# EAGLE design PSX_Radio (EAGLE 9.6.2)
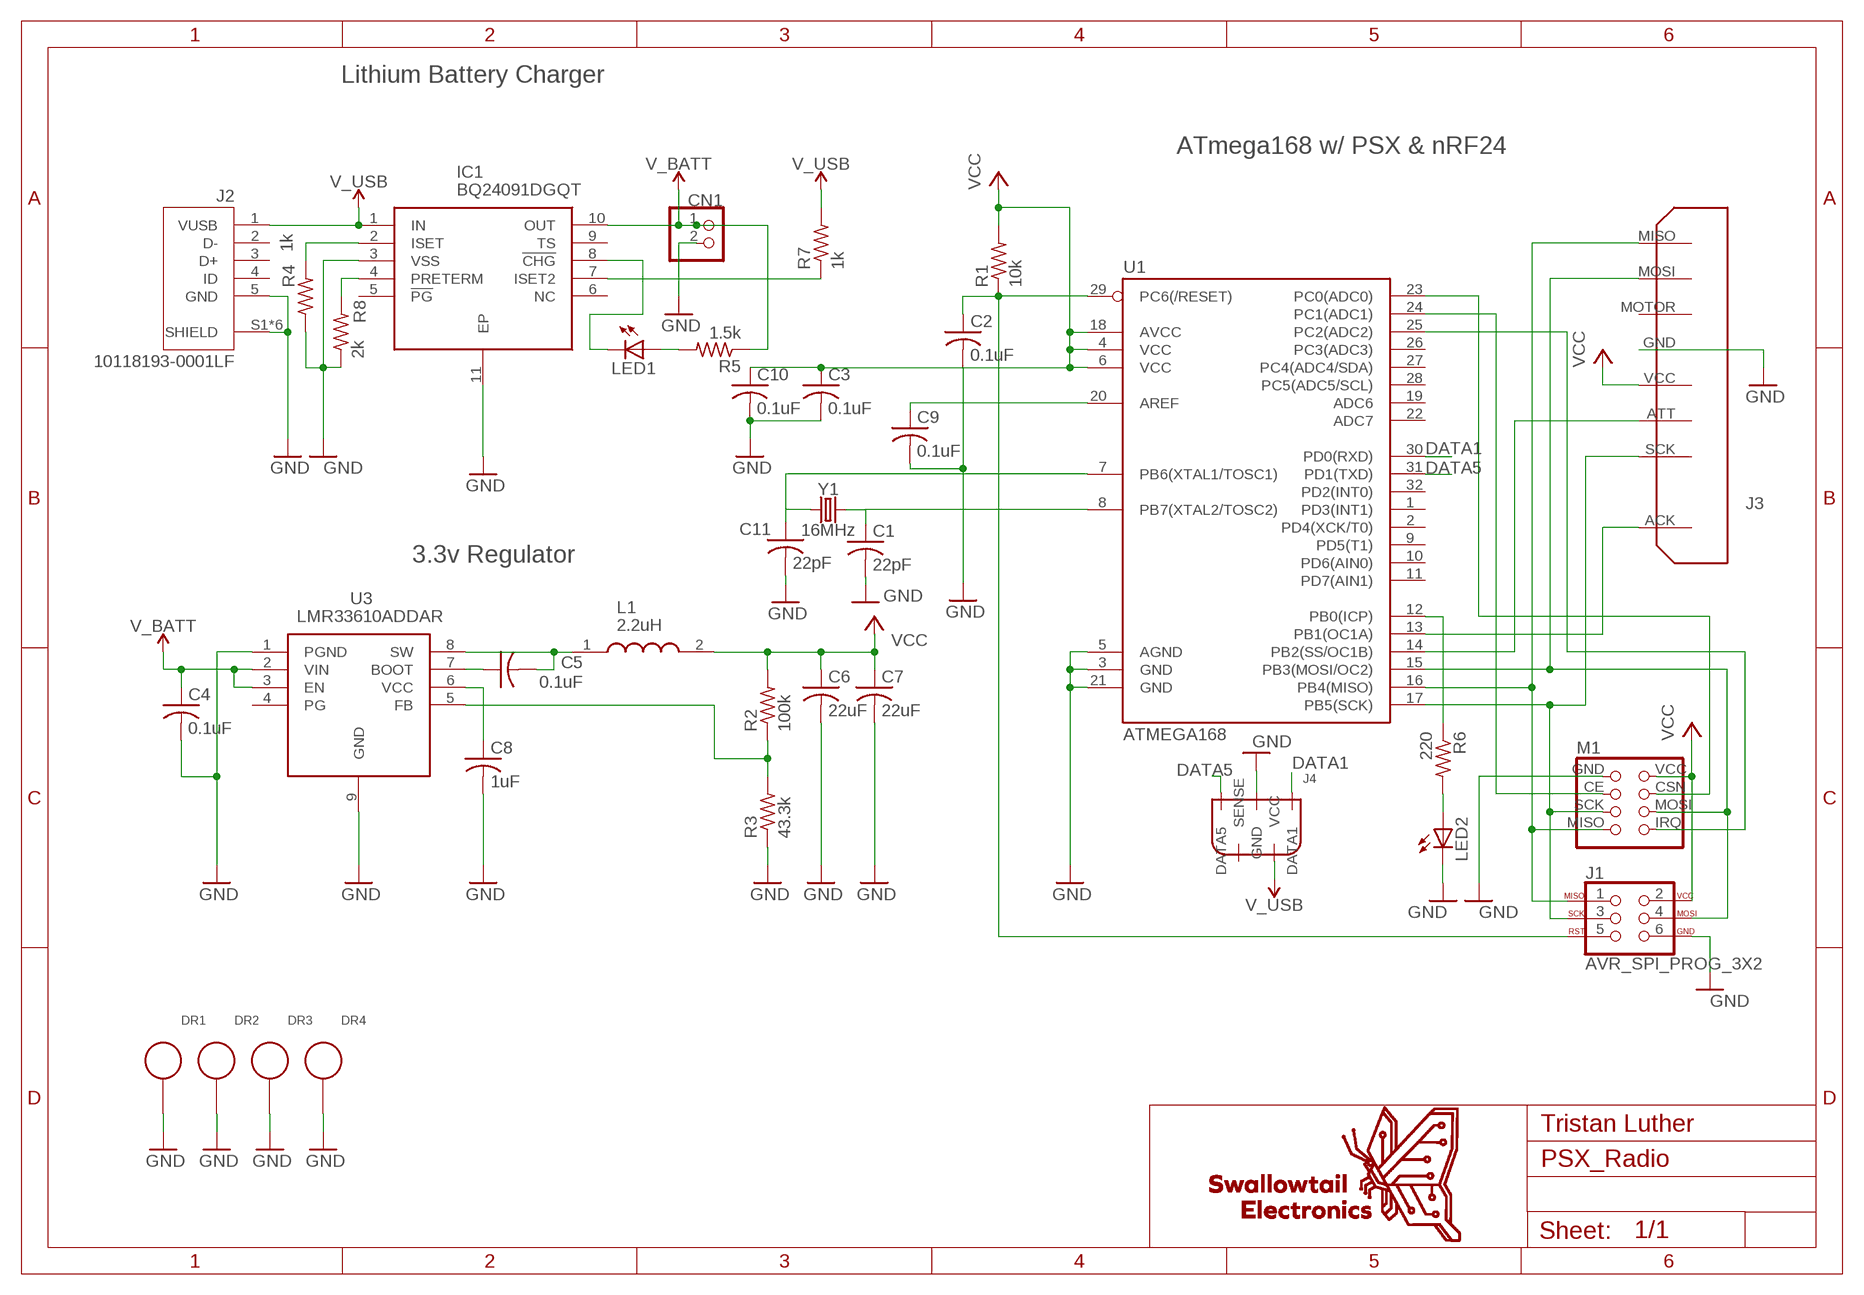
[diagram p0: schematic, sheet 1]

## Parts
C1  22pF  C-USC0805  [C0805]
C2  0.1uF  C-USC0805  [C0805]
C3  0.1uF  C-USC0805  [C0805]
C4  0.1uF  C-USC0805  [C0805]
C5  0.1uF  C-USC0805  [C0805]
C6  22uF  C-USC0805  [C0805]
C7  22uF  C-USC0805  [C0805]
C8  1uF  C-USC0805  [C0805]
C9  0.1uF  C-USC0805  [C0805]
C10  0.1uF  C-USC0805  [C0805]
C11  22pF  C-USC0805  [C0805]
CN1  JST_2PIN-SMT-RA  [JST-PH-2-SMT-RA]
DR1  3MM_DRILL_GND  [3MM_DRILL_GND]
DR2  3MM_DRILL_GND  [3MM_DRILL_GND]
DR3  3MM_DRILL_GND  [3MM_DRILL_GND]
DR4  3MM_DRILL_GND  [3MM_DRILL_GND]
IC1  BQ24091DGQT  [SOP50P490X110-11N]
J1  AVR_SPI_PROG_3X2  [2X3-NS]
J2  10118193-0001LF  [FCI_10118193-0001LF]
J3  PSX_CONTROLLER  [PSX_VERTICAL]
J4  DREAMCAST_CONTROLLER  [1X06]
L1  2.2uH  SRP5015TA-2R2M  [INDPM5752X150N]
LED1  LED5MM  [LED5MM]
LED2  LED5MM  [LED5MM]
M1  NRF24L01_MODULE  [2X04]
R1  10k  R-US_R0805  [R0805]
R2  100k  R-US_R0805  [R0805]
R3  43.3k  R-US_R0805  [R0805]
R4  1k  R-US_R0805  [R0805]
R5  1.5k  R-US_R0805  [R0805]
R6  220  R-US_R0805  [R0805]
R7  1k  R-US_R0805  [R0805]
R8  2k  R-US_R0805  [R0805]
U1  ATMEGA168  [TQFP32-08]
U3  LMR33610ADDAR  [SOIC127P600X170-9N]
Y1  16MHz  CRYSTAL-16MHZSMD-5X3.2  [CRYSTAL-SMD-5X3.2-4PAD]

## Nets
DATA1: J4.2(DATA1) U1.30(PD0(RXD))
DATA5: J4.4(DATA5) U1.31(PD1(TXD))
GND: C1.2 C2.2 C3.2 C4.2 C6.2 C7.2 C8.2 C9.2 C10.2 C11.2 CN1.2 DR1.DR(D$1) DR2.DR(D$1) DR3.DR(D$1) DR4.DR(D$1) IC1.3(VSS) IC1.11(EP) J1.6 J2.5(GND) J2.S1(SHIELD) J2.S2(SHIELD) J2.S3(SHIELD) J2.S4(SHIELD) J2.S5(SHIELD) J2.S6(SHIELD) J3.GND J4.5(GND) LED2.K(C) M1.GND R3.1 R4.1 R8.1 U1.3(GND) U1.5(AGND) U1.21(GND) U3.1(PGND) U3.9(GND)
N$1: J1.1 J3.MISO M1.MISO U1.16(PB4(MISO))
N$2: J1.4 J3.MOSI M1.MOSI U1.15(PB3(MOSI/OC2))
N$3: J3.ACK U1.13(PB1(OC1A))
N$4: M1.IRQ U1.25(PC2(ADC2))
N$5: J1.3 J3.SCK M1.SCK U1.17(PB5(SCK))
N$6: M1.CE U1.24(PC1(ADC1))
N$7: J3.ATT U1.14(PB2(SS/OC1B))
N$8: M1.CSN U1.23(PC0(ADC0))
N$9: C2.1 J1.5 R1.1 U1.29(PC6(/RESET))
N$10: C9.1 U1.20(AREF)
N$11: C5.1 U3.7(BOOT)
N$12: C5.2 L1.1 U3.8(SW)
N$13: IC1.2(ISET) R4.2
N$14: R2.1 R3.2 U3.5(FB)
N$15: C8.1 U3.6(VCC)
N$16: R6.1 U1.12(PB0(ICP))
N$17: LED2.A R6.2
N$18: C1.1 U1.8(PB7(XTAL2/TOSC2)) Y1.3
N$19: C11.1 U1.7(PB6(XTAL1/TOSC1)) Y1.1
N$20: LED1.A R5.2
N$21: IC1.8(!CHG) LED1.K(C)
N$22: IC1.7(ISET2) R7.1
N$23: IC1.4(PRETERM) R8.2
V_BATT: C4.1 CN1.1 IC1.10(OUT) R5.1 U3.2(VIN) U3.3(EN)
V_USB: IC1.1(IN) J2.1(VUSB) J4.1(VCC) R7.2
VCC: C3.1 C6.1 C7.1 C10.1 J1.2 J3.VCC L1.2 M1.VCC R1.2 R2.2 U1.4(VCC) U1.6(VCC) U1.18(AVCC)
Unconnected: IC1.5(!PG) IC1.6(NC) IC1.9(TS) J2.2(D-) J2.3(D+) J2.4(ID) J3.MOTOR J4.6(SENSE) U1.1(PD3(INT1)) U1.2(PD4(XCK/T0)) U1.9(PD5(T1)) U1.10(PD6(AIN0)) U1.11(PD7(AIN1)) U1.19(ADC6) U1.22(ADC7) U1.26(PC3(ADC3)) U1.27(PC4(ADC4/SDA)) U1.28(PC5(ADC5/SCL)) U1.32(PD2(INT0)) U3.4(PG)

## Notes on the sheet
- Lithium Battery Charger
- ATmega168 w/ PSX & nRF24
- 3.3v Regulator

## Library data of the parts
C1-C11 = MyLibrary:C-US: CAPACITOR, American symbol
CN1 = MyLibrary:JST_2PIN: JST 2-Pin Connectors of various flavors SMT-RA (S2B-PH-SM4) 4UConnector #17311 SMT (B2B-PH-SM4) THM-RA (S2B-PH) THM (B2B-PH)
DR1-DR4 = MyLibrary:3MM_DRILL_GND: Common 3mm Machine Screw Hole. Better than your standard drill! Connects to the ground of the circuit board to the enclosure.
IC1 = Swallowtail_PowerManagment:BQ24091DGQT: Texas Instruments BQ24091DGQT, Battery Charge Controller, 1000mA, 10-Pin MSOP Source: Datasheet <http://www.ti.com/lit/gpn/bq24091>; ARROW_PART_NUMBER: BQ24091DGQT; ARROW_PRICE-STOCK: https://www.arrow.com/en/products/bq24091dgqt/texas-instruments; DESCRIPTION: Texas Instruments BQ24091DGQT, Battery Charge Controller, 1000mA, 10-Pin MSOP; HEIGHT: 1.1mm; MANUFACTURER_NAME: Texas Instruments; MANUFACTURER_PART_NUMBER: BQ24091DGQT; MOUSER_PART_NUMBER: 595-BQ24091DGQT; MOUSER_PRICE-STOCK: https://www.mouser.co.uk/ProductDetail/Texas-Instruments/BQ24091DGQT?qs=%252BneE8T2%2Fs3QJg504Q752sQ%3D%3D
J1 = MyLibrary:AVR_SPI_PROG_3X2: AVR ISP 6 Pin This is the reduced ISP connector for AVR programming. Common on Arduino. This footprint will take up less PCB space and can be used with a 10-pin to 6-pin adapter such as SKU: BOB-08508 **Special note about "TEST_POINT" package. The stop mask is on the top side, so if you want your programming test points to be on the bottom of your board, make sure to place this package on the bottom side of the board. This also ensure that the orientation to program from the bottom side will be correct. SparkFun Products: SparkFun ISP Pogo Adapter <https://www.sparkfun.com/products/11591> - NS Tiny AVR Programmer <https://www.sparkfun.com/products/11801> -PTH
J2 = MyLibrary:10118193-0001LF: Micro USB B Type Receptacle; AVAILABILITY: Unavailable; DESCRIPTION: USB - micro B USB 2.0 Receptacle Connector 5 Position Surface Mount, Right Angle; Through Hole; MF: Amphenol ICC; MP: 10118193-0001LF; PACKAGE: None; PRICE: None
J3 = MyLibrary:PSX_CONTROLLER
J4 = MyLibrary:DREAMCAST_CONTROLLER
L1 = MyLibrary:SRP5015TA-2R2M: Bourns SRP5015TA Series Shielded Wire-wound SMD Inductor with a Carbonyl Powder Core, 2.2 H Wire-Wound 4A Idc Q:10 Source: Datasheet <https://www.bourns.com/docs/Product-Datasheets/SRP5015TA.pdf>; ARROW_PART_NUMBER: SRP5015TA-2R2M; ARROW_PRICE-STOCK: https://www.arrow.com/en/products/srp5015ta-2r2m/bourns; DESCRIPTION: Bourns SRP5015TA Series Shielded Wire-wound SMD Inductor with a Carbonyl Powder Core, 2.2 H Wire-Wound 4A Idc Q:10; HEIGHT: 1.5mm; MANUFACTURER_NAME: Bourns; MANUFACTURER_PART_NUMBER: SRP5015TA-2R2M; MOUSER_PART_NUMBER: 652-SRP5015TA-2R2M; MOUSER_PRICE-STOCK: https://www.mouser.co.uk/ProductDetail/Bourns/SRP5015TA-2R2M?qs=ZwKJWZfDtNjiXC2UrFyYsA%3D%3D
LED1 LED2 = MyLibrary:LED: LED OSRAM: - CHIPLED LG R971, LG N971, LY N971, LG Q971, LY Q971, LO R971, LY R971 LH N974, LH R974 LS Q976, LO Q976, LY Q976 LO Q996 - Hyper CHIPLED LW Q18S LB Q993, LB Q99A, LB R99A - SideLED LS A670, LO A670, LY A670, LG A670, LP A670 LB A673, LV A673, LT A673, LW A673 LH A674 LY A675 LS A676, LA A676, LO A676, LY A676, LW A676 LS A679, LY A679, LG A679 - Hyper Micro SIDELED® LS Y876, LA Y876, LO Y876, LY Y876 LT Y87S - SmartLED LW L88C, LW L88S LB L89C, LB L89S, LG L890 LS L89K, LO L89K, LY L89K LS L896, LA L896, LO L896, LY L896 - TOPLED LS T670, LO T670, LY T670, LG T670, LP T670 LSG T670, LSP T670, LSY T670, LOP T670, LYG T670 LG T671, LOG T671, LSG T671 LB T673, LV T673, LT T673, LW T673 LH T674 LS T676, LA T676, LO T676, LY T676, LB T676, LH T676, LSB T676, LW T676 LB T67C, LV T67C, LT T67C, LS T67K, LO T67K, LY T67K, LW E67C LS E67B, LA E67B, LO E67B, LY E67B, LB E67C, LV E67C, LT E67C LW T67C LS T679, LY T679, LG T679 LS T770, LO T770, LY T770, LG T770, LP T770 LB T773, LV T773, LT T773, LW T773 LH T774 LS E675, LA E675, LY E675, LS T675 LS T776, LA T776, LO T776, LY T776, LB T776 LHGB T686 LT T68C, LB T68C - Hyper Mini TOPLED® LB M676 - Mini TOPLED Santana® LG M470 LS M47K, LO M47K, LY M47K Source: http://www.osram.convergy.de/
M1 = MyLibrary:NRF24L01_MODULE: NRF24L01 2.4GHz Radio Module
R1-R8 = MyLibrary:R-US_: RESISTOR, American symbol
U1 = MyLibrary:ATMEGA168: ATMEGA 168 Atmel 32-pin 8-bit micro, 16k flash. SparkFun Products SparkFun Serial Graphic LCD 128x64 <https://www.sparkfun.com/products/9351> (LCD-09351) SparkFun Graphic LCD Serial Backpack <https://www.sparkfun.com/products/9352> (LCD-09352) SparkFun Serial Graphic LCD 160x128 <https://www.sparkfun.com/products/8884> (LCD-08884); PROD_ID: IC-08594
U3 = MyLibrary:LMR33610ADDAR: SIMPLE SWITCHER 3.8V to 36V, 3A Synchronous Buck Converter With Ultra-Low EMI Source: Datasheet <http://www.ti.com/lit/gpn/lmr33630>; ARROW_PART_NUMBER: LMR33630ADDAR; ARROW_PRICE-STOCK: https://www.arrow.com/en/products/lmr33630addar/texas-instruments; DESCRIPTION: SIMPLE SWITCHER 3.8V to 36V, 3A Synchronous Buck Converter With Ultra-Low EMI; HEIGHT: 1.7mm; MANUFACTURER_NAME: Texas Instruments; MANUFACTURER_PART_NUMBER: LMR33630ADDAR; MOUSER_PART_NUMBER: 595-LMR33630ADDAR; MOUSER_PRICE-STOCK: https://www.mouser.co.uk/ProductDetail/Texas-Instruments/LMR33630ADDAR?qs=r5DSvlrkXmJQkBTqgVdiDA%3D%3D
Y1 = MyLibrary:CRYSTAL-16MHZ: 16MHz Crystal Digikey Example <http://www.digikey.com/product-search/en?keywords=535-9122-1-ND> Frequency: 16MHz Frequency Stability: ±50ppm Frequency Tolerance: ±20ppm Load Capacitance: 18pF SparkFun Products: Pro Micro -5V/16MHz <https://www.sparkfun.com/products/12640> SparkFun Serial Enabled LCD Kit <https://www.sparkfun.com/products/10097>; PROD_ID: XTAL-08218; SF_ID: COM-00094

## Board
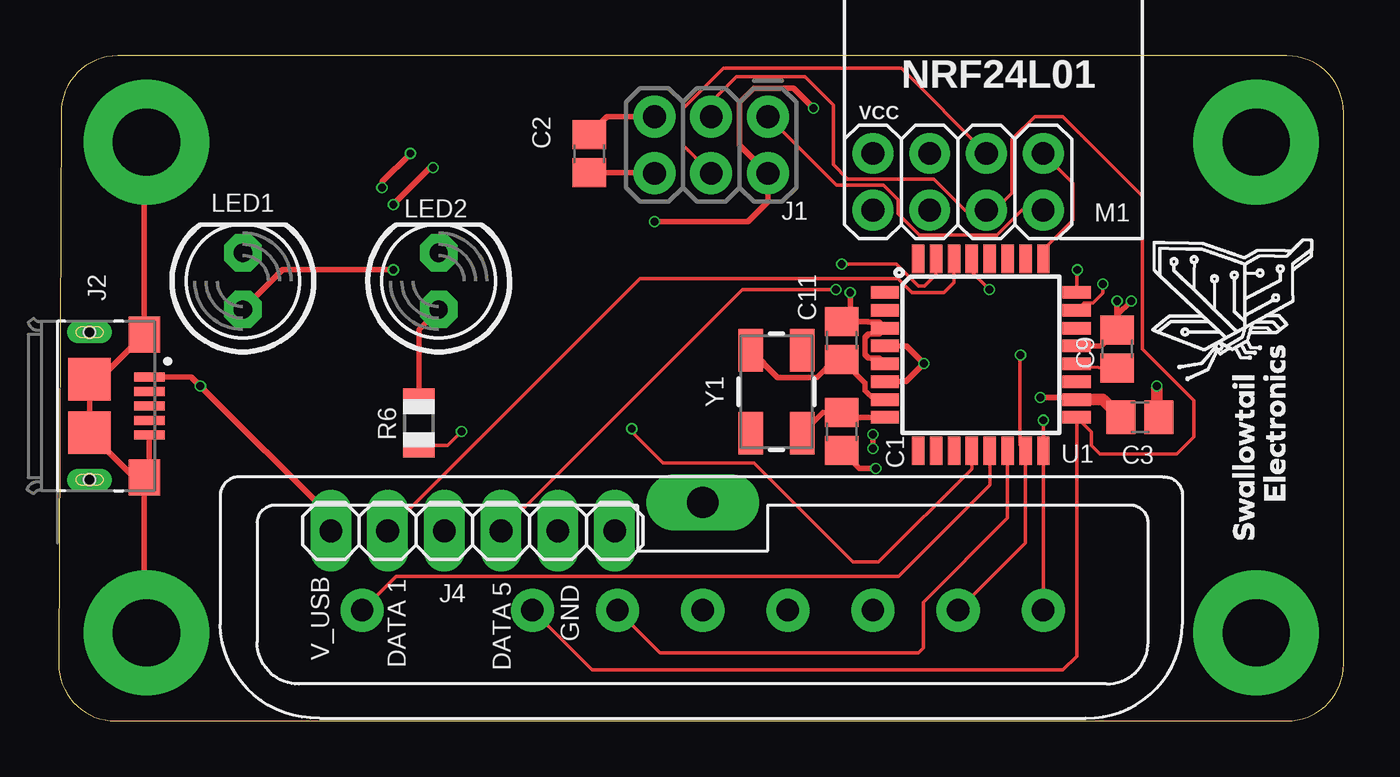
[diagram p1: board, top side]
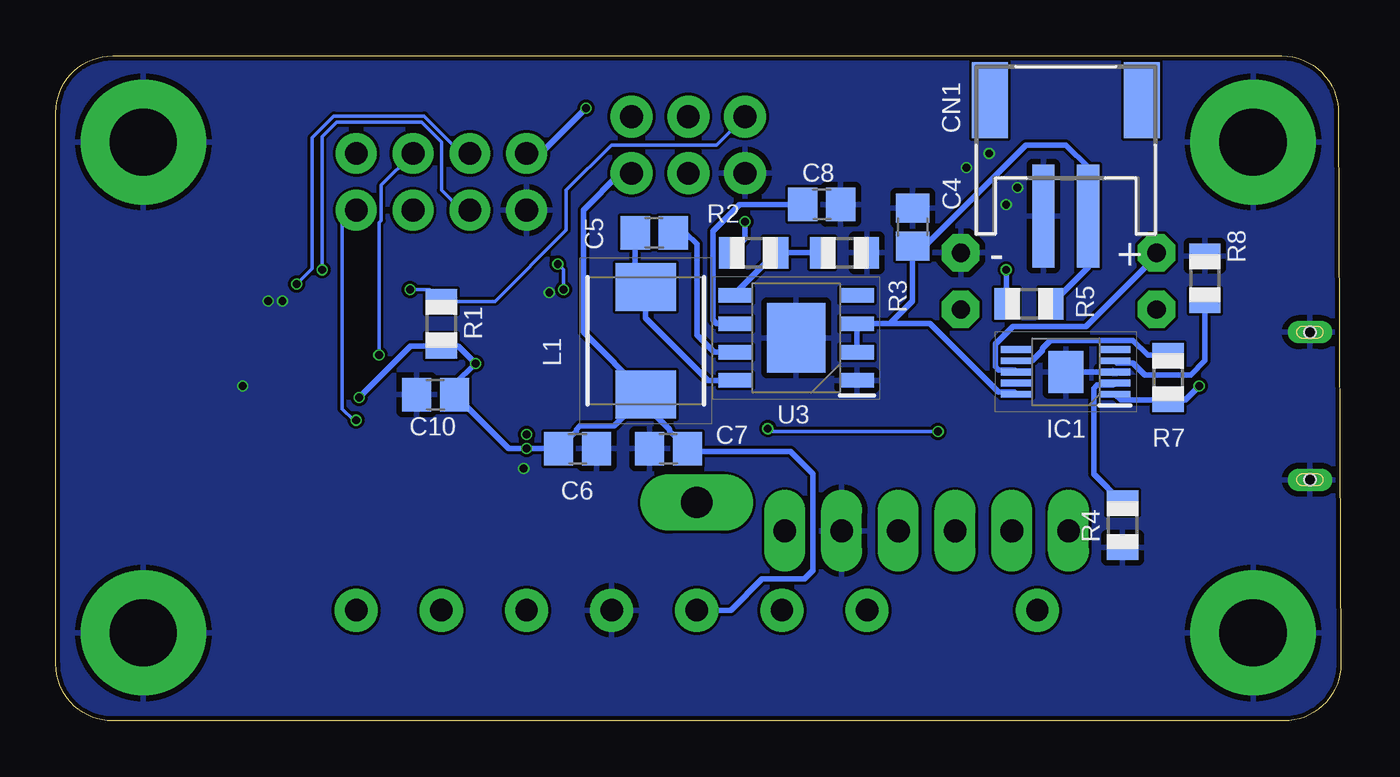
[diagram p2: board, bottom side, seen from below]

Size 57.5 x 29.77 mm. Coordinates in mm from the lower left corner, seen from the top.
Outline: 0.11,27.24 0,2.55 arc90 2.54,0 54.96,0 arc90 57.5,2.54 57.5,27.23 arc90 54.96,29.77 2.65,29.77 arc90 0.11,27.24
Copper layers (1*16): Top 0.035mm / dielectric 1.6mm / Bottom 0.035mm
Design rules "jlcpcb-eagle": minimum track width 5mil, minimum drill 0.3mm, track to track 5mil, track to pad 5mil, pad to pad 5mil, via to via 5mil, smd to smd 5mil, copper to edge 0.2mm, drill to drill 6mil, minimum pad ring 10mil, minimum via ring 3mil, stop-mask expansion 4mil, vias tented up to drill 0mil, thermal gap 10mil

### Footprints (pad centres in the part's own frame; a part is rotated, then mirrored left to right if it is on the bottom)
C0805 = smd 1.3 x 1.5: 1 -0.85,0; 2 0.85,0
JST-PH-2-SMT-RA = smd 1 x 4.6: 1 1,-3.7; 2 -1,-3.7 | smd 1.6 x 3.4: NC1 -3.4,1.5; NC2 3.4,1.5
3MM_DRILL_GND = drill 3 pad 5.6: DR 0,0.127
SOP50P490X110-11N = smd 1.4 x 0.3: 1 -2.2,1; 2 -2.2,0.5; 3 -2.2,0; 4 -2.2,-0.5; 5 -2.2,-1; 6 2.2,-1; 7 2.2,-0.5; 8 2.2,0; 9 2.2,0.5; 10 2.2,1 | smd 1.57 x 1.88: 11 0,0
2X3-NS = drill 1.016 pad 1.88: 1 -2.54,-1.27; 2 -2.54,1.27; 3 0,-1.27; 4 0,1.27; 5 2.54,-1.27; 6 2.54,1.27
FCI_10118193-0001LF = smd 0.4 x 1.35: 1 -1.3,2.675; 2 -0.65,2.675; 3 0,2.675; 4 0.65,2.675; 5 1.3,2.675 | smd 1.6 x 1.4: S1 -3.2,2.45; S2 3.2,2.45 | smd 1.9 x 1.9: S3 1.2,0; S4 -1.2,0 | drill 0.5 pad 0.9 long: S5 -3.3,0; S6 3.3,0 | hole 0.5: -3.3,0; 3.3,0
PSX_VERTICAL = drill 1 pad 1.93: ACK -15.24,0; ATT -3.81,0; GND 3.81,0; MISO 15.24,0; MOSI 11.43,0; MOTOR 7.62,0; SCK -7.62,0; VCC 0,0 | drill 1.4 pad 1.93 long: PLUG 0,4.826
1X06 = drill 1.016 long: 1 -6.35,0; 2 -3.81,0; 3 -1.27,0; 4 1.27,0; 5 3.81,0; 6 6.35,0
INDPM5752X150N = smd 2.15 x 2.7: 1 -2.4,0; 2 2.4,0
LED5MM = drill 0.813 pad 1.676 octagon: A -1.27,0; K 1.27,0
2X04 = drill 1.016 pad 1.676: CE -1.27,-1.27; CSN -1.27,1.27; GND -3.81,-1.27; IRQ 3.81,1.27; MISO 3.81,-1.27; MOSI 1.27,1.27; SCK 1.27,-1.27; VCC -3.81,1.27
R0805 = smd 1.1 x 1.4: 1 -1,0; 2 1,0
TQFP32-08 = smd 1.27 x 0.559: 1 -4.293,2.8; 2 -4.293,2; 3 -4.293,1.2; 4 -4.293,0.4; 5 -4.293,-0.4; 6 -4.293,-1.2; 7 -4.293,-2; 8 -4.293,-2.8; 17 4.293,-2.8; 18 4.293,-2; 19 4.293,-1.2; 20 4.293,-0.4; 21 4.293,0.4; 22 4.293,1.2; 23 4.293,2; 24 4.293,2.8 | smd 0.559 x 1.27: 9 -2.8,-4.293; 10 -2,-4.293; 11 -1.2,-4.293; 12 -0.4,-4.293; 13 0.4,-4.293; 14 1.2,-4.293; 15 2,-4.293; 16 2.8,-4.293; 25 2.8,4.293; 26 2,4.293; 27 1.2,4.293; 28 0.4,4.293; 29 -0.4,4.293; 30 -1.2,4.293; 31 -2,4.293; 32 -2.8,4.293
SOIC127P600X170-9N = smd 1.525 x 0.65: 1 -2.712,1.905; 2 -2.712,0.635; 3 -2.712,-0.635; 4 -2.712,-1.905; 5 2.712,-1.905; 6 2.712,-0.635; 7 2.712,0.635; 8 2.712,1.905 | smd 2.6 x 3.1: 9 0,0
CRYSTAL-SMD-5X3.2-4PAD = smd 1.9 x 1.1: 1 -1.85,-1.15; 2 1.85,-1.15; 3 1.85,1.15; 4 -1.85,1.15

### Placement (x,y rotation side)
C1  35.04,12.95 270 top
C2  23.74,25.4 270 top
C3  48.38,13.59 0 top
C4  19.17,22.1 90 bottom
C5  30.72,21.84 180 bottom
C6  34.15,12.19 0 bottom
C7  30.09,12.19 180 bottom
C8  23.23,23.11 0 bottom
C9  47.36,16.64 90 top
C10  40.5,14.61 180 bottom
C11  35.04,17.02 90 top
CN1  12.31,26.29 0 bottom
DR1  3.93,3.81 0 top
DR2  3.93,25.78 0 top
DR3  53.58,25.78 0 top
DR4  53.58,3.81 0 top
IC1  12.31,15.62 180 bottom
J1  29.2,25.78 180 top
J2  1.39,14.1 270 top
J3  28.82,4.95 0 top
J4  18.53,8.51 0 top
L1  31.1,17.02 270 bottom
LED1  8.24,19.68 90 top
LED2  17.01,19.68 90 top
M1  40.25,24.13 0 top
R1  40.25,17.78 270 bottom
R2  26.28,20.95 180 bottom
R3  22.21,20.95 180 bottom
R4  9.77,8.76 90 bottom
R5  13.96,18.67 180 bottom
R6  16.12,13.34 90 top
R7  7.74,15.37 270 bottom
R8  6.09,19.81 270 bottom
U1  41.26,16.38 0 top
U3  24.37,17.14 180 bottom
U$3  [SWALLOWTAIL_LOGO_SMALL]  56.12,8.13 90 top
Y1  32.12,14.73 270 top

### Tracks (layer width: path | path; a pad name or v marks a point on that pad's centre or on a via)
DATA1
  Top 0.152: J4.2 26.01,19.79 37.56,19.79 38.18,19.18 39.61,19.18 40.06,19.63 U1.30
DATA5  (via drill 0.35)
  Top 0.152: U1.31 39.26,19.97 38.75,19.46 38.48,19.46 37.49,20.45 v35.04,20.45 | J4.4 30.6,19.3 v34.79,19.3
  Bottom 0.152: v34.79,19.3 34.79,20.19 v35.04,20.45
GND  (via drill 0.35)
  Top 0.254: C2.2 26.62,24.55 J1.6 | C9.2 v47.36,18.8 | v48,18.8 47.36,18.16 C9.2 | U1.21 46.66,16.78 C9.2 | J2.S2 3.39,10.9 J2.S3 J2.S4 1.84,15.3 J2.S1 3.84,25.82 DR2.DR | J2.5 4.06,11.12 J2.S2 | J2.S2 3.84,4.03 DR1.DR | C11.2 35.17,17.87 | 35.17,17.87 36.21,17.87 36.23,17.85 36.71,17.85 U1.3 36.71,17.32 36.23,17.32 36.08,17.17 36.08,16.4 36.23,16.25 36.71,16.25 U1.5 | v35.42,19.18 35.42,18.12 35.17,17.87 | C1.2 35.84,11.3 v36.57,11.3 | v14.47,23.88 14.47,24.13 v15.74,25.4 | v14.98,23.11 16.63,24.77 v16.75,24.77
  Top 0.508: C3.2 49.14,13.68 v49.14,14.99
  Bottom 0.254: IC1.3 IC1.11
  pour Bottom: 57.52,27.18 57.52,2.54 arc-90 54.98,0 2.53,0 arc-90 -0.01,2.54 -0.01,27.18 arc-90 2.53,29.72 54.98,29.72 arc-90
N$1  (via drill 0.35)
  Top 0.152: J3.MISO U1.16 v44.06,13.46 | M1.MISO 43.1,22.86 41.98,21.74 38.52,21.74 37.56,22.7 37.56,23.32 36.9,23.98 34.81,23.98 J1.1
  Bottom 0.152: v44.06,13.46 44.19,13.46 44.69,13.97 44.69,22.23 M1.MISO
N$2  (via drill 0.35)
  Top 0.152: J3.MOSI 43.26,7.97 U1.15 43.01,12.34 43.01,16.35 v43.04,16.38 | M1.MOSI 37.71,29.21 29.74,29.21 27.93,27.4 27.93,25.78 J1.4
  Bottom 0.152: v43.04,16.38 43.04,22.3 42.94,22.4 42.94,23.98 M1.MOSI
N$3
  Top 0.152: J3.ACK 15.1,6.48 37.58,6.48 41.66,10.56 U1.13
N$4
  Top 0.152: U1.25 44.06,21.1 45.38,22.42 45.38,24.08 M1.IRQ
N$5
  Top 0.152: J3.SCK 23.87,2.29 44.95,2.29 45.56,2.9 U1.17 46.22,12.92 46.22,12.32 46.6,11.94 50.03,11.94 50.79,12.7 50.79,14.35 48.5,16.64 48.5,23.5 44.95,27.05 43.68,27.05 42.66,26.04 42.66,23.62 41.9,22.86 M1.SCK 40.56,22.86 39.16,24.26 35.3,24.26 34.66,24.89 34.66,27.56 33.39,28.83 30.34,28.83 29.2,27.69 J1.3
N$6  (via drill 0.35)
  Top 0.152: U1.24 45.56,20.17 v45.58,20.19
  Bottom 0.152: v45.58,20.19 45.58,26.16 44.95,26.8 41.14,26.8 40.25,25.91 40.25,23.75 39.36,22.86 M1.CE
N$7
  Top 0.152: J3.ATT 26.91,3.05 38.47,3.05 38.7,3.28 38.7,5.31 42.46,9.07 U1.14
N$8  (via drill 0.35)
  Top 0.152: U1.23 45.87,18.7 46.28,18.7 46.73,19.15 v46.73,19.56
  Bottom 0.152: v46.73,19.56 46.04,20.25 46.04,26.1 45.06,27.08 41.02,27.08 39.35,25.4 M1.CSN
N$9  (via drill 0.35)
  Top 0.152: U1.29 40.86,20.09 v41.65,19.3
  Top 0.254: C2.1 24.54,27.05 J1.5
  Bottom 0.152: v41.65,19.3 40.77,19.3 R1.1 37.85,18.78 34.66,21.97 34.66,23.75 32.63,25.78 27.93,25.78 J1.5
N$10
  Top 0.152: C9.1 45.7,15.84 U1.20
N$11
  Bottom 0.254: U3.7 28.06,16.51 28.82,17.27 28.82,21.34 29.33,21.84 C5.1
N$12
  Bottom 0.254: U3.8 28.31,15.24 31.1,18.03 L1.1 31.57,19.89 C5.2
N$13
  Bottom 0.254: IC1.2 10.2,15.03 10.91,15.03 11.06,14.88 11.06,11.06 R4.2
N$14
  Bottom 0.254: R3.2 R2.1 27.09,19.15 U3.5
N$15
  Bottom 0.254: C8.1 26.91,23.11 28.1,21.93 28.1,17.95 27.93,17.78 U3.6
N$16  (via drill 0.35)
  Top 0.152: U1.12 40.86,11.28 36.69,7.11 35.55,7.11 31.1,11.56 27.04,11.56 25.64,12.95 v25.64,13.08 | v18.02,12.95 17.4,12.34 R6.1
  Bottom 0.152: v18.02,12.95 25.52,12.95 v25.64,13.08
N$17
  Top 0.254: LED2.A 16.12,17.53 R6.2
N$18
  Top 0.254: U1.8 35.26,13.58 C1.1 34.19,13.8 Y1.3
N$19
  Top 0.254: Y1.1 32.17,15.38 33.93,15.38 34.72,16.17 C11.1 36.08,15.13 36.08,14.8 36.5,14.38 U1.7
N$20  (via drill 0.35)
  Top 0.254: LED1.A 10.02,20.19 v14.98,20.19
  Bottom 0.254: R5.2 14.96,20.18 v14.98,20.19
N$21
  Bottom 0.254: IC1.8 14.6,15.72 15.31,15.72 15.46,15.87 15.46,16.88 14.69,17.65 11.42,17.65 8.24,20.83 LED1.K
N$22
  Bottom 0.254: IC1.7 13.8,16.12 13.35,16.57 13.35,16.67 12.99,17.02 9.3,17.02 8.65,16.37 R7.1
N$23
  Bottom 0.254: IC1.4 10.01,16.02 9.3,16.02 8.77,15.49 6.72,15.49 6.09,16.13 R8.2
V_BATT
  Bottom 0.254: U3.2 U3.3 | U3.3 20.18,17.78 19.17,18.8 C4.1 18.62,21.25 14.09,25.78 12.31,25.78 11.31,24.78 CN1.1 11.31,20.32 R5.1 | IC1.10 14.6,14.72 15.31,14.72 18.38,17.78 U3.3
V_USB  (via drill 0.35)
  Top 0.254: J2.1 5.93,15.4 v6.34,14.99 12.18,9.14 J4.1
  Bottom 0.254: IC1.1 9.85,14.37 R7.2 6.96,14.37 v6.34,14.99
VCC  (via drill 0.35)
  Top 0.254: U1.6 37.91,15.18 v38.72,16 37.94,16.78 U1.4 | v43.93,14.48 45.46,14.48 U1.18 | v36.44,12.83 v36.44,12.19 | v26.66,22.35 30.85,22.35 31.74,23.24 J1.2 30.47,25.78 30.47,27.69 31.1,28.32 32.88,28.32 v33.77,27.43
  Top 0.508: U1.18 46.73,14.38 C3.1
  Bottom 0.254: v43.93,14.48 41.63,16.78 R1.2 39.5,16.78 v38.72,16 39.65,15.07 C10.1 37.24,12.19 v36.44,12.19 C6.1 34.21,12.99 34.21,13.05 34.06,13.2 32.53,13.2 L1.2 | L1.2 31.1,14.12 30.03,13.05 30.03,12.99 C7.1 29.11,12.06 24.63,12.06 23.61,11.05 23.61,6.73 23.99,6.35 25.9,6.35 27.29,4.95 J3.VCC | R2.2 26.66,21.57 v26.66,22.35 | L1.2 33.9,17.41 33.9,22.86 32.25,24.51 J1.2 | v33.77,27.43 35.8,25.4 M1.VCC

### Text on the board
tNames: V_USB | DATA 1 | DATA 5 | GND
tValues: Charge | Status
bValues: Playcast Radio / Swallowtail Electronics 2021 / Tristan Luther